# Altium schematic sheet HBridge.SchDoc
size A4; SheetNumber: 5; SheetTotal: 7
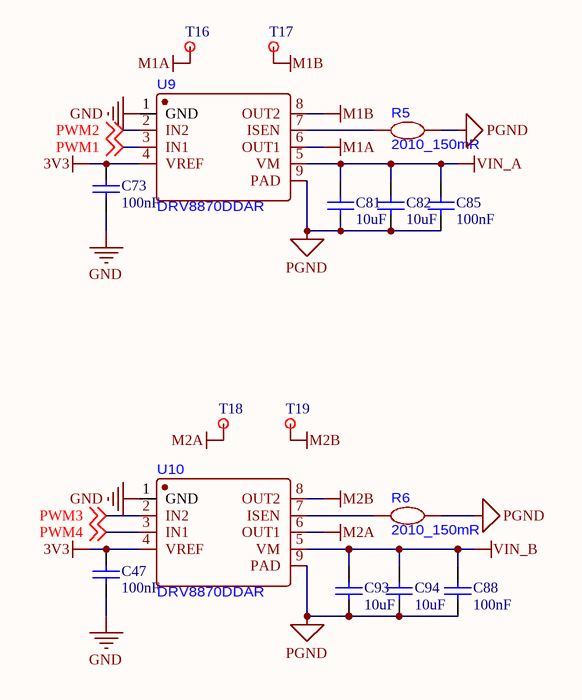
[diagram p0: HBridge.SchDoc]

## Parts
C47  100nF  [0402_C]
C73  100nF  [0402_C]
C81  10uF  [1206_C]
C82  10uF  [1206_C]
C85  100nF  [0402_C]
C88  100nF  [0402_C]
C93  10uF  [1206_C]
C94  10uF  [1206_C]
R5  2010_150mR  [R2010]
R6  2010_150mR  [R2010]
T16  testpoint  [testpoint]  (value not drawn)
T17  testpoint  [testpoint]  (value not drawn)
T18  testpoint  [testpoint]  (value not drawn)
T19  testpoint  [testpoint]  (value not drawn)
U9  DRV8870DDAR  [HSOP-8_L5.0-W4.0-P1.27-LS6.2-BL-EP]
U10  DRV8870DDAR  [HSOP-8_L5.0-W4.0-P1.27-LS6.2-BL-EP]

## Nets
3V3: C47.2 C73.2 U9.4(VREF) U10.4(VREF)
GND: C47.1 C73.1 U9.1(GND) U10.1(GND)
M1A: T16.1(R) U9.6(OUT1)
M1B: T17.1(R) U9.8(OUT2)
M2A: T18.1(R) U10.6(OUT1)
M2B: T19.1(R) U10.8(OUT2)
PGND: C81.1 C82.1 C85.1 C88.1 C93.1 C94.1 R5.2 R6.2 U9.9(PAD) U10.9(PAD)
VIN_A: C81.2 C82.2 C85.2 U9.5(VM)
VIN_B: C88.2 C93.2 C94.2 U10.5(VM)
PWM1: U9.3(IN1) ; off-sheet PWM1
PWM2: U9.2(IN2) ; off-sheet PWM2
PWM3: U10.2(IN2) ; off-sheet PWM3
PWM4: U10.3(IN1) ; off-sheet PWM4
NetR5_1: R5.1 U9.7(ISEN)
NetR6_1: R6.1 U10.7(ISEN)

## Library data of the parts
C47 C73 C85 C88 = 0402 100nF (104) 10% 16V: 贴片电容; ComponentLink1Description: 供应商链接; ComponentLink1URL: http://www.szlcsc.com/product/details_1877.html; Package: 0402; Supplier: LC; SuppliersPartNumber: C1525
C81 C82 C93 C94 = 1206 10uF (106) 10% 50V: 贴片电容; ComponentLink1Description: 供应商链接; ComponentLink1URL: http://www.szlcsc.com/product/details_14236.html; Package: 1206; Supplier: LC; SuppliersPartNumber: C13585